# Altium project AUTOMATSKO_PODMAZIVANJE.PrjPcb
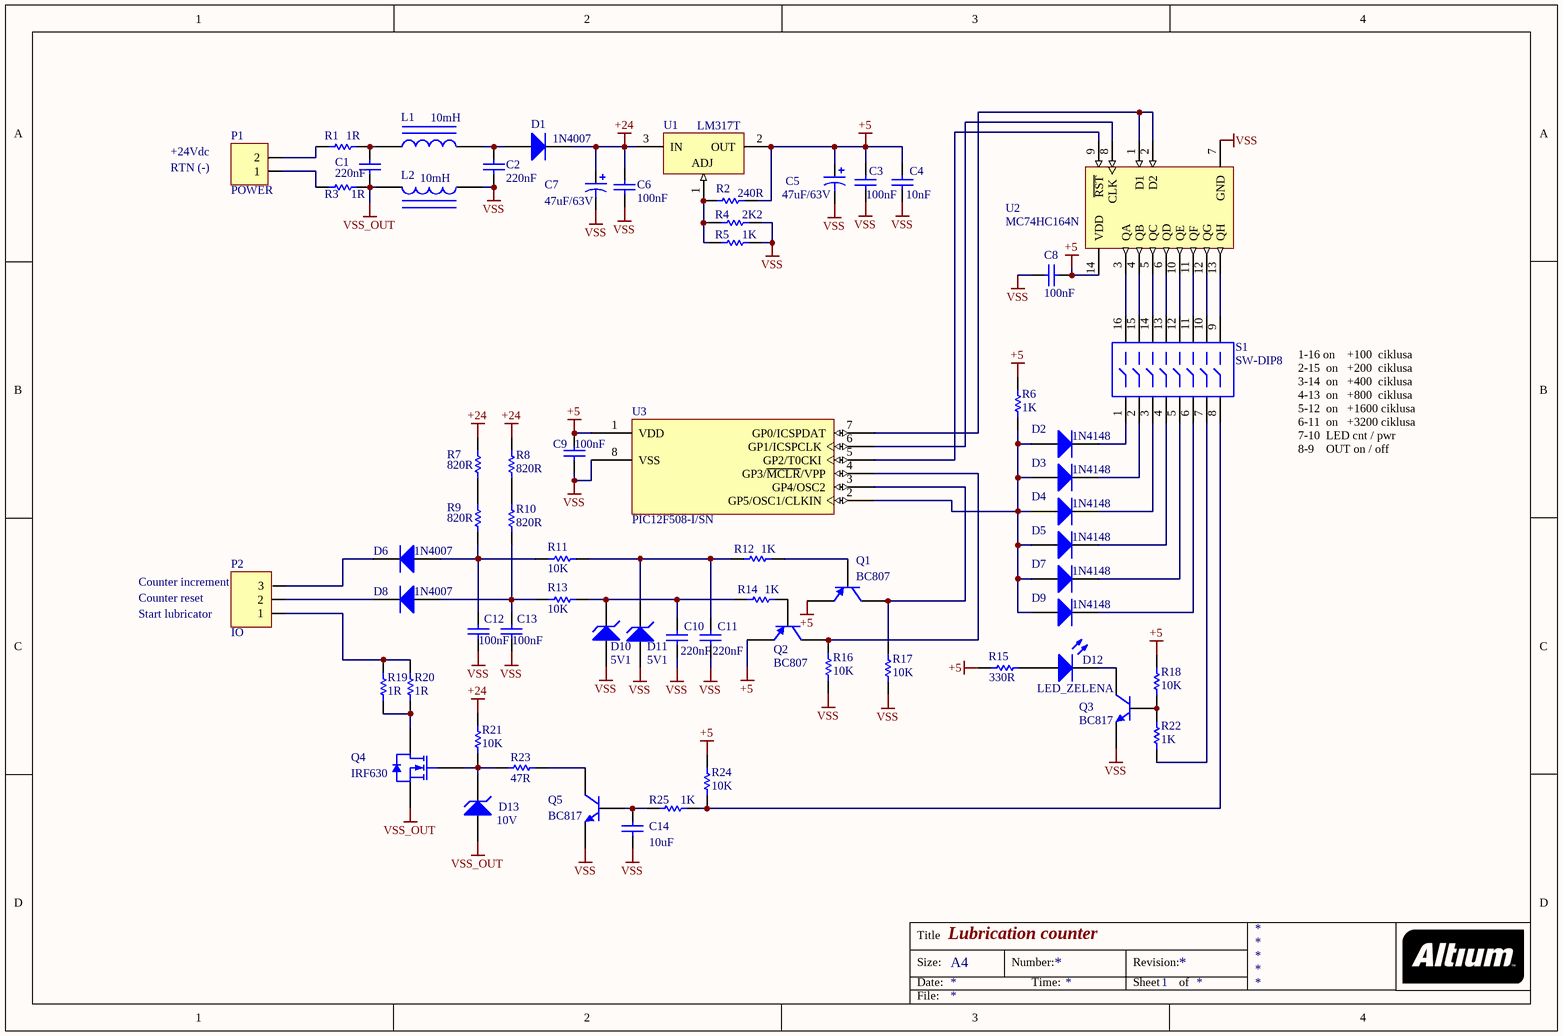
[diagram p0: AUTOMATSKO_PODMAZIVANJE.SchDoc]
1 sheet, 65 parts. Net scope: global (net labels, ports and power ports of the same name join across sheets).
Board file: AUTOMATSKO_PODMAZIVANJE.PcbDoc

## Sheet AUTOMATSKO_PODMAZIVANJE.SchDoc: Lubrication counter
size A4; Author: eldar6776@hotmail.com; CompanyName: PROVEN d.o.o.; DrawnBy: Eldar Dedic; SheetNumber: 1; ProjectName: lbr_ctrl

### Parts
C1  220nF  [VP60-6.3]
C2  220nF  [VP60-6.3]
C3  value 100nF  [1206]
C4  value 10nF  [0805]
C5  47uF/63V  [CAPPR2-5X11]
C6  value 100nF  [1206]
C7  47uF/63V  [CAPPR2-5X11]
C8  value 100nF  [1206]
C9  value 100nF  [1206]
C10  value 220nF  [0805]
C11  value 220nF  [0805]
C12  value 100nF  [1206]
C13  value 100nF  [1206]
C14  value 10uF  [1206]
D1  1N4007  [DO-41]
D2  1N4148  [D-64]
D3  1N4148  [D-64]
D4  1N4148  [D-64]
D5  1N4148  [D-64]
D6  1N4007  [DO-41]
D7  1N4148  [D-64]
D8  1N4007  [DO-41]
D9  1N4148  [D-64]
D10  5V1  [DO-35]
D11  5V1  [DO-35]
D12  LED_ZELENA  [LED-1]
D13  10V  [DO-35]
L1  value 10mH  [AXIAL-0.4]
L2  value 10mH  [AXIAL-0.4]
P1  POWER  [TERMINAL KONEKTOR 2]
P2  IO  [TERMINAL KONEKTOR 3]
Q1  BC807  [SOT-23B_N]
Q2  BC807  [SOT-23B_N]
Q3  BC817  [318-08]
Q4  IRF630  [TO-220AB]
Q5  BC817  [318-08]
R1  1R  [ERA-0805]
R2  240R  [ERA-0805]
R3  1R  [ERA-0805]
R4  2K2  [ERA-0805]
R5  1K  [ERA-0805]
R6  1K  [ERA-0805]
R7  820R  [ERA-0805]
R8  820R  [ERA-0805]
R9  820R  [ERA-0805]
R10  820R  [ERA-0805]
R11  10K  [ERA-0805]
R12  1K  [ERA-0805]
R13  10K  [ERA-0805]
R14  1K  [ERA-0805]
R15  330R  [ERA-0805]
R16  10K  [ERA-0805]
R17  10K  [ERA-0805]
R18  10K  [ERA-0805]
R19  1R  [ERA-0805]
R20  1R  [ERA-0805]
R21  10K  [ERA-0805]
R22  1K  [ERA-0805]
R23  47R  [ERA-0805]
R24  10K  [ERA-0805]
R25  1K  [ERA-0805]
S1  SW-DIP8  [DIP-16-KEY]
U1  LM317T  [221A-04]
U2  MC74HC164N  [646-06]
U3  PIC12F508-I/SN  [SOIC-SN8_N]

### Nets
+5: C3.2 C4.2 C5.1 C8.1 C9.1 Q1.3(E) Q2.3(E) R2.1 R6.2 R15.2 R18.2 R24.1 U1.2(OUT) U2.14(VDD) U3.1(VDD)
+24: C6.2 C7.1 D1.2(K) R7.2 R8.2 R21.2 U1.3(IN)
VSS: C2.1 C3.1 C4.1 C5.2 C6.1 C7.2 C8.2 C9.2 C10.1 C11.1 C12.1 C13.1 C14.1 D10.1(A) D11.1(A) L2.1 Q3.2(E) Q5.2(E) R4.2 R5.2 R16.1 R17.1 U2.7(GND) U3.8(VSS)
VSS_OUT: C1.1 D13.1(A) L2.2 Q4.3(S) R3.1
NetC1_2: C1.2 L1.1 R1.1
NetC2_2: C2.2 D1.1(A) L1.2
NetC10_2: C10.2 D10.2(K) R13.1 R14.1
NetC11_2: C11.2 D11.2(K) R11.1 R12.1
NetC12_2: C12.2 D6.1(A) R9.1 R11.2
NetC13_2: C13.2 D8.1(A) R10.1 R13.2
NetC14_2: C14.2 Q5.1(B) R25.1
NetD2_1: D2.1(A) D3.1(A) D4.1(A) D5.1(A) D7.1(A) D9.1(A) R6.1 U3.2(GP5/OSC1/CLKIN)
NetD2_2: D2.2(K) S1.1
NetD3_2: D3.2(K) S1.2
NetD4_2: D4.2(K) S1.3
NetD5_2: D5.2(K) S1.4
NetD6_2: D6.2(K) P2.3
NetD7_2: D7.2(K) S1.5
NetD8_2: D8.2(K) P2.2
NetD9_2: D9.2(K) S1.6
NetD12_1: D12.1(A) R15.1
NetD12_2: D12.2(K) Q3.3(C)
NetD13_2: D13.2(K) Q4.1(G) R21.1 R23.2
NetP1_1: P1.1 R3.2
NetP1_2: P1.2 R1.2
NetP2_1: P2.1 R19.1 R20.1
NetQ1_1: Q1.1(C) R17.2 U3.3(GP4/OSC2)
NetQ1_2: Q1.2(B) R12.2
NetQ2_1: Q2.1(C) R16.2 U3.4(GP3/~{MCLR}/VPP)
NetQ2_2: Q2.2(B) R14.2
NetQ3_1: Q3.1(B) R18.1 R22.2
NetQ4_2: Q4.2(D) R19.2 R20.2
NetQ5_3: Q5.3(C) R23.1
NetR2_2: R2.2 R4.1 R5.1 U1.1(ADJ)
NetR7_1: R7.1 R9.2
NetR8_1: R8.1 R10.2
NetR22_1: R22.1 S1.7
NetR24_2: R24.2 R25.2 S1.8
NetS1_9: S1.9 U2.13(QH)
NetS1_10: S1.10 U2.12(QG)
NetS1_11: S1.11 U2.11(QF)
NetS1_12: S1.12 U2.10(QE)
NetS1_13: S1.13 U2.6(QD)
NetS1_14: S1.14 U2.5(QC)
NetS1_15: S1.15 U2.4(QB)
NetS1_16: S1.16 U2.3(QA)
NetU2_1: U2.1(D1) U2.2(D2) U3.7(GP0/ICSPDAT)
NetU2_8: U2.8(CLK) U3.6(GP1/ICSPCLK)
NetU2_9: U2.9(~{RST}) U3.5(GP2/T0CKI)

### Notes on the sheet
- +24Vdc
- RTN (-)
- 1-16 on    +100  ciklusa
  2-15  on   +200  ciklusa
  3-14  on   +400  ciklusa
  4-13  on   +800  ciklusa
  5-12  on   +1600 ciklusa
  6-11  on   +3200 ciklusa
  7-10  LED cnt / pwr
  8-9    OUT on / off
- (near P2) Counter increment
- Counter reset
- (near P2) Start lubricator
- Title
- Size:
- Date:
- A4
- Number:
- Time:
- Revision:
- Sheet
- of
- File:

### Library data of the parts
C1 C2 = VP60BY565MB: Dipped Radial Multilayer Ceramic Capacitor X7R: 5.6uF, 100V; Published: 17-Dec-2003; LatestRevisionDate: 19-Mar-2004; LatestRevisionNote: PCB Footprint - Drill hole diameter reduced.; DatasheetDocument: 2-Jan-2002; PackageDocument: 2-Jan-2002; PackageReference: VP60-6.3; Publisher: Altium Limited; ComponentLink1Description: Manufacturer Link; ComponentLink1URL: http://www.vishay.com/; Value: 5.6uF
C3 C6 C8 C9 C12-C14 = C1206: Ceramic Chip Capacitor - Standard; Published: 17-Jul-2002; LatestRevisionDate: 19-Mar-2004; LatestRevisionNote: Silkscreen size reduced.; DatasheetDocument: Mar-2001; PackageDocument: Mar-2001; PackageReference: 1206; Publisher: Altium Limited; Code_JEITA: 1206; Code_IPC: 3216 [1206]; ComponentLink1Description: Manufacturer Link; ComponentLink1URL: http://www.kemet.com/; ComponentLink2Description: Datasheet; ComponentLink2URL: http://www.kemet.com/kemet/web/homepage/kechome.nsf/vapubfilesname/F3102TA.pdf/$file/F3102TA.pdf
C4 C10 C11 = C0805: Ceramic Chip Capacitor - Standard; Note: Footprint corresponds to dimensions for bulk cassette packaging. This case size has tightened tolerances.; Published: 17-Jul-2002; LatestRevisionDate: 19-Mar-2004; LatestRevisionNote: Silkscreen size reduced.; DatasheetDocument: Mar-2001; PackageDocument: Mar-2001; PackageReference: 0805; Publisher: Altium Limited; Code_JEITA: 0805; Code_IPC: 2012[0805]; ComponentLink1Description: Manufacturer Link; ComponentLink1URL: http://www.kemet.com/; ComponentLink2Description: Datasheet; ComponentLink2URL: http://www.kemet.com/kemet/web/homepage/kechome.nsf/vapubfilesname/F3102TA.pdf/$file/F3102TA.pdf
C5 C7 = EKA00AA322C00: Aluminum Electrolytic Capacitor, Radial Style with Long Leads: 220uF, 10V; Note: Refer to Manufacturer's Data Sheets for other lead formations; DrillSize: Nominal, Rounded To The Nearest 0.1mm; Published: 19-Mar-2004; DatasheetDocument: 20-Feb-2001; PackageReference: CAPPR2-5X11; Publisher: Altium Limited; ComponentLink1Description: Manufacturer Link; ComponentLink1URL: http://www.vishay.com/; ComponentLink2Description: Datasheet; ComponentLink2URL: http://www.vishay.com/docs/25014/eka.pdf; Value: 220uF
D1 D6 D8 = Diode 1N4007: 1 Amp General Purpose Rectifier; Published: 8-Jun-2000; LatestRevisionDate: 17-Jul-2002; LatestRevisionNote: Re-released for DXP Platform.; DatasheetVersion: 1998; PackageVersion: Aug-1999; PackageReference: DO-41; Publisher: Altium Limited; PackageDescription: Diode, Axial; Body 5.2 x 2.7 mm (LxDia. max), Lead Dia. 0.86 mm (max); Code_JEDEC: DO-204-AL; ComponentLink1Description: Manufacturer Link; ComponentLink1URL: http://www.fairchildsemi.com/; ComponentLink2Description: Datasheet; ComponentLink2URL: http://www.fairchildsemi.com/ds/1N%2F1N4001.pdf
D2-D5 D7 D9 = Diode: Default Diode; Published: 8-Jun-2000; LatestRevisionDate: 17-Jul-2002; LatestRevisionNote: Re-released for DXP Platform.; PackageVersion: Sep-1996; PackageReference: SMC; Publisher: Altium Limited; PackageDescription: DO-214-AB/SMC; 2 C-Bend Leads; Body 7.9 x 5.9 mm, inc. leads (LxW); Code_JEDEC: DO-214-AB
D10 D11 D13 = D Zener: Zener Diode; Published: 8-Jun-2000; LatestRevisionDate: 17-Jul-2002; LatestRevisionNote: Re-released for DXP Platform.; PackageReference: DIODE-0.7; Publisher: Altium Limited; PackageDescription: Diode, Thru-Hole; 2 Leads; 0.7 in Pin Spacing
D12 = LED1: Typical RED GaAs LED; Published: 8-Jun-2000; LatestRevisionDate: 08-Jul-2005; LatestRevisionNote: Mech Layer 1 removed.; PackageReference: LED-1; Publisher: Altium Limited; PackageDescription: LED; 2 Leads
L1 L2 = Inductor Iron: Magnetic-Core Inductor; Published: 24-Mar-1999; LatestRevisionDate: 17-Jul-2002; LatestRevisionNote: Re-released for DXP Platform.; PackageReference: AXIAL-0.9; Publisher: Altium Limited; PackageDescription: Axial Device, Thru-Hole; 2 Leads; 0.9 in Pin Spacing
P1 = CON: KONEKTOR 2 PINA
P2 = TERMINAL KONEKTOR 3 PINA: TERMINAL KONEKTOR 3
Q1 Q2 = PNP: PNP Bipolar Transistor; Published: 8-Jun-2000; LatestRevisionDate: 29-May-2009; LatestRevisionNote: IPC-7351 Footprint Added.; PackageVersion: Aug-1999; PackageReference: SOT-23B; Publisher: Altium Limited; PackageDescription: 3-Pin SOT-23 Package 0.95 mm Pitch, 2.4 mm Lead Span
Q3 Q5 = BC817-16LT1: General Purpose Transistor NPN Silicon; Published: 29-Sep-2000; LatestRevisionDate: 17-Jul-2002; LatestRevisionNote: Re-released for DXP Platform.; DatasheetVersion: 1997; PackageVersion: 1997; PackageReference: 318-08; Publisher: Altium Limited; PackageDescription: SOT-23; 3 Leads; Body 3.0 x 2.6 mm, inc. leads (LxW max); ComponentLink1Description: Manufacturer Link; ComponentLink1URL: http://www.onsemi.com/site/products/landing?taxonomyID=194; ComponentLink2Description: Datasheet; ComponentLink2URL: http://www.onsemi.com/pub/Collateral/BC817-16LT1-D.PDF
Q4 = SUP75N06-08: N-Channel 60V (D-S), 175'C  MOSFET; Note: Pin 2 (Drain) is connected to TAB; Published: 8-Jun-2000; LatestRevisionDate: 17-Jul-2002; LatestRevisionNote: Re-released for DXP Platform.; DatasheetVersion: 24-Feb-1998; PackageReference: TO-220AB; Publisher: Altium Limited; PackageDescription: TO, Thru-Hole, Vertical, Heatsink Mounted; 3 In-Line Leads; Pitch 2.54 mm; Code_JEDEC: TO-220-AB-alt; ComponentLink1Description: Manufacturer Link; ComponentLink1URL: http://www.vishay.com/
R1-R25 = ERA6Y: Rectangular Thick Film Chip Resistor, 10 Ohm to 1M Ohm Range, 0.1% and 0.5% Tolerance, 0805 Size, 0.1 W; Note: If flow soldering, adjust pad width of PCB Footprint to 0.7 - 0.8 times the width of the resistor.; Published: 17-Dec-2003; LatestRevisionDate: 19-Mar-2004; LatestRevisionNote: Silkscreen size reduced.; PackageDocument: Mar-2003; PackageReference: ERA-0805; Publisher: Altium Limited; Code_IPC: 2012 [0805]; ComponentLink1Description: Manufacturer Link; ComponentLink1URL: http://www.panasonic.com/industrial/components/resistive_products.htm; ComponentLink2Description: Datasheet; ComponentLink2URL: http://www.panasonic.com/industrial/components/pdf/AOA0000CE8.pdf
S1 = SW-DIP8: 4009 Series DIP Switch, Raised actuator; Published: 24-Mar-1999; LatestRevisionDate: 17-Dec-2003; LatestRevisionNote: PCB Footprint replaced.; PackageReference: DIP-16-KEY; Publisher: Altium Limited; PackageDescription: DIP; 16 Leads; Row Spacing 7.62 mm; Pitch 2.54 mm; ComponentLink1Description: Manufacturer Link; ComponentLink1URL: http://www.oupiin.com/prodindx.html#Headers
U1 = LM317T: 3-Terminal Adjustable Positive Voltage Regulator; Note: Heatsink surface connected to pin 2.; Published: 17-Jul-2002; DatasheetVersion: 1988; PackageReference: 221A-04; Publisher: Altium Limited; PackageDescription: TO, Thru-Hole, Vertical, Heatsink Mounted; 3 In-Line Leads; Pitch 2.54 mm; Code_JEDEC: TO-262-AA; ComponentLink1Description: Manufacturer Link; ComponentLink1URL: http://www.onsemi.com/site/products/taxonomy/0,4438,503,00.html; ComponentLink2Description: Datasheet; ComponentLink2URL: http://www.onsemi.com/pub/Collateral/LM317-D.PDF
U2 = MC74HC164N: 8-Bit Serial-Input/Parallel-Output Shift Register; Published: 17-Jul-2002; LatestRevisionDate: 06-Jun-2005; LatestRevisionNote: Stylized 3D Model Added; DatasheetVersion: 1989; PackageVersion: 1997; PackageReference: 646-06; Publisher: Altium Limited; PackageDescription: DIP; 14 Leads; Row Spacing 7.62 mm; Pitch 2.54 mm; ComponentLink1Description: Manufacturer Link; ComponentLink1URL: http://www.onsemi.com/site/products/parametrics/0,4446,557,00.html
U3 = PIC12F508-I/SN: 8-bit Flash Microcontroller, 512 (x12-Bit words) Program Memory, 25 Bytes Data Memory, 8-Pin SOIC, Industrial Temperature; Published: 29-Jan-2009; LatestRevisionDate: 02-Dec-2009; LatestRevisionNote: Updated to datasheet revision revE, Aug-2009; DatasheetVersion: revE, Aug-2009; PackageVersion: revBB, Aug-2009; PackageReference: SOIC-SN8; Publisher: Altium Limited; PackageDescription: 8-Lead Plastic Small Outline (SN) - Narrow, 3.90mm Body [SOIC]; Supplier 1: Digi-Key; Supplier Part Number 1: PIC12F508-I/SN-ND; Supplier 2: Farnell; Supplier Part Number 2: 1212715; Code_JEDEC: MS-012; Code_IPC: SOIC127P600-8; ComponentLink1Description: Datasheet; ComponentLink1URL: http://ww1.microchip.com/downloads/en/DeviceDoc/41236E.pdf; ComponentLink2Description: Packaging Specification; ComponentLink2URL: http://www.microchip.com/stellent/groups/techpub_sg/documents/packagingspec/en012702.pdf; ComponentLink3Description: Microchip.com Home; ComponentLink3URL: http://www.microchip.com/